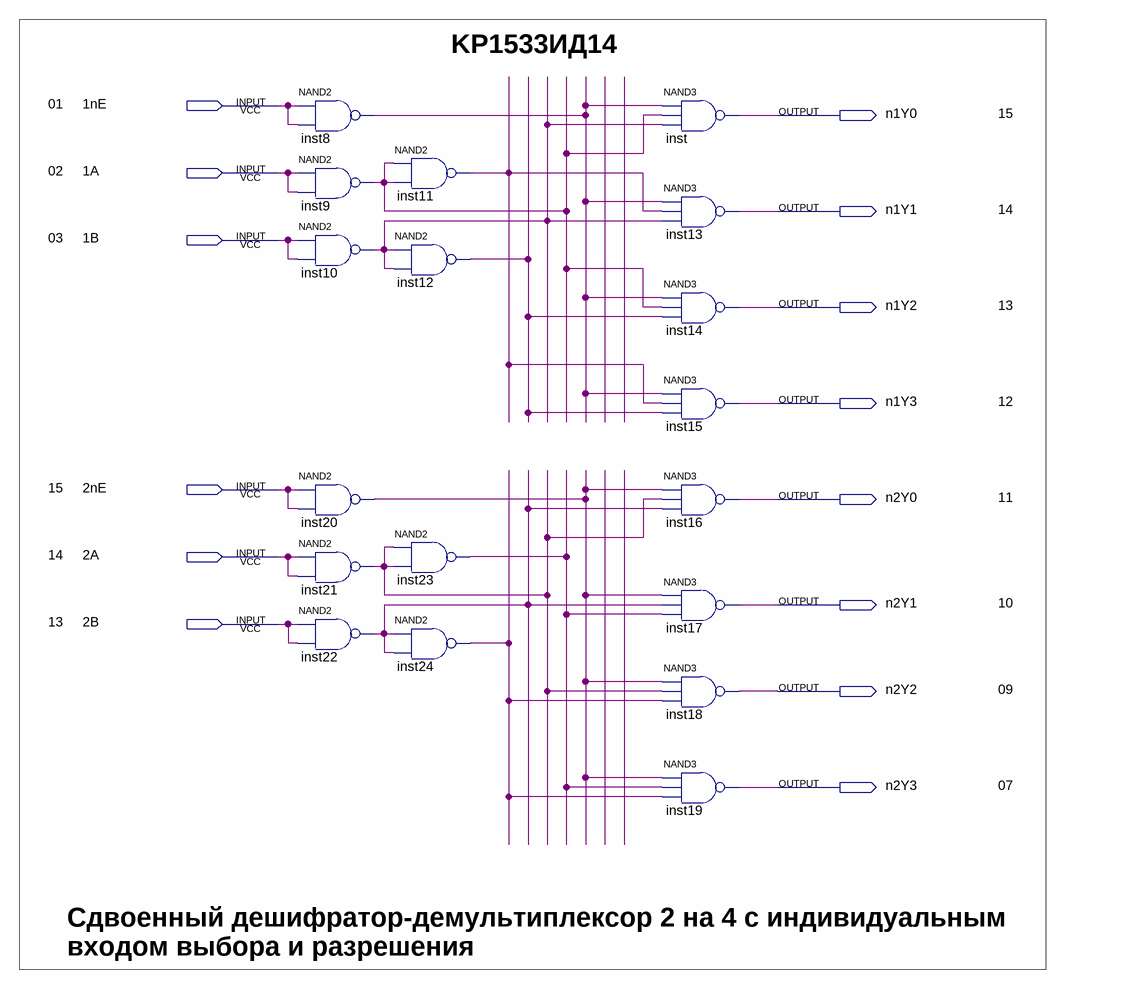
[diagram p0: schematic sheet]
// Quartus schematic KP1533ID14.bdf as structural Verilog: 18 symbols, 14 pins
module KP1533ID14 (
  input  \1nE ,
  input  \1A ,
  input  \1B ,
  input  \2nE ,
  input  \2A ,
  input  \2B ,
  output n1Y0,
  output n1Y1,
  output n1Y2,
  output n1Y3,
  output n2Y0,
  output n2Y1,
  output n2Y2,
  output n2Y3
);

  wire inst8_out, inst9_out, inst10_out, inst11_out, inst12_out, inst20_out, inst21_out, inst22_out,
       inst23_out, inst24_out;

  nand inst8 (inst8_out, \1nE , \1nE );
  nand inst9 (inst9_out, \1A , \1A );
  nand inst10 (inst10_out, \1B , \1B );
  nand inst20 (inst20_out, \2nE , \2nE );
  nand inst21 (inst21_out, \2A , \2A );
  nand inst22 (inst22_out, \2B , \2B );
  nand inst11 (inst11_out, inst9_out, inst9_out);
  nand inst12 (inst12_out, inst10_out, inst10_out);
  nand inst23 (inst23_out, inst21_out, inst21_out);
  nand inst24 (inst24_out, inst22_out, inst22_out);
  nand inst (n1Y0, inst8_out, inst9_out, inst10_out);
  nand inst13 (n1Y1, inst8_out, inst11_out, inst10_out);
  nand inst14 (n1Y2, inst8_out, inst9_out, inst12_out);
  nand inst15 (n1Y3, inst8_out, inst11_out, inst12_out);
  nand inst16 (n2Y0, inst20_out, inst21_out, inst22_out);
  nand inst17 (n2Y1, inst20_out, inst22_out, inst23_out);
  nand inst18 (n2Y2, inst20_out, inst21_out, inst24_out);
  nand inst19 (n2Y3, inst20_out, inst23_out, inst24_out);

  // Notes on the sheet:
  //   KP1533ИД14
  //   01
  //   15
  //   02
  //   14
  //   03
  //   13
  //   12
  //   15
  //   11
  //   14
  //   10
  //   13
  //   09
  //   07
  //   Сдвоенный дешифратор-демультиплексор 2 на 4 с индивидуальным
  //   входом выбора и разрешения
endmodule
